# EAGLE design bwrev4 (EAGLE 8.5.0)
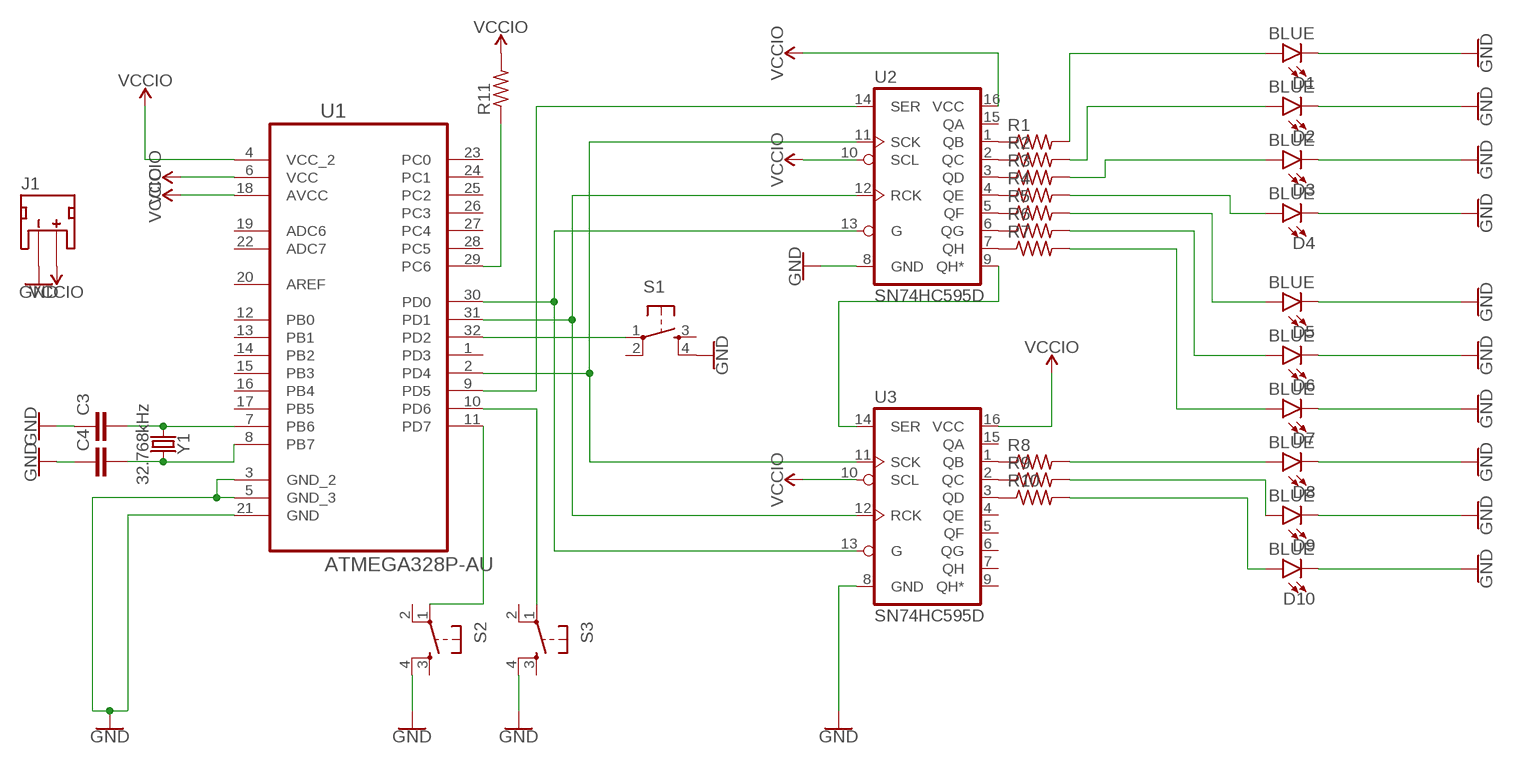
[diagram p0: schematic, sheet 1]

## Parts
C3  C-EUC0805  [C0805]
C4  C-EUC0805  [C0805]
D1  BLUE  LED-BLUE1206  [LED-1206]
D2  BLUE  LED-BLUE1206  [LED-1206]
D3  BLUE  LED-BLUE1206  [LED-1206]
D4  BLUE  LED-BLUE1206  [LED-1206]
D5  BLUE  LED-BLUE1206  [LED-1206]
D6  BLUE  LED-BLUE1206  [LED-1206]
D7  BLUE  LED-BLUE1206  [LED-1206]
D8  BLUE  LED-BLUE1206  [LED-1206]
D9  BLUE  LED-BLUE1206  [LED-1206]
D10  BLUE  LED-BLUE1206  [LED-1206]
J1  JST_2MM_MALE  [JST-2-SMD]
R1  R-US_M0805  [M0805]
R2  R-US_M0805  [M0805]
R3  R-US_M0805  [M0805]
R4  R-US_M0805  [M0805]
R5  R-US_M0805  [M0805]
R6  R-US_M0805  [M0805]
R7  R-US_M0805  [M0805]
R8  R-US_M0805  [M0805]
R9  R-US_M0805  [M0805]
R10  R-US_M0805  [M0805]
R11  R-US_M0805  [M0805]
S1  TAC_SWITCHPTH  [TACTILE-PTH]
S2  TAC_SWITCHPTH  [TACTILE-PTH]
S3  TAC_SWITCHPTH  [TACTILE-PTH]
U1  ATMEGA328P-AU  [QFP80P900X900X120-32N]
U2  SN74HC595D  74HC595D  [SO16]
U3  SN74HC595D  74HC595D  [SO16]
Y1  32.768kHz  CRYSTAL-32.768KHZSMD-3.2X1.5  [CRYSTAL-SMD-3.2X1.5MM]

## Nets
GND: C3.1 C4.1 D1.C D2.C D3.C D4.C D5.C D6.C D7.C D8.C D9.C D10.C J1.1(-) S1.4 S2.4 S3.4 U1.3(GND_2) U1.5(GND_3) U1.21(GND) U2.8(GND) U3.8(GND)
N$1: S1.1 U1.32(PD2)
N$2: R1.1 U2.1(QB)
N$3: R2.1 U2.2(QC)
N$4: R3.1 U2.3(QD)
N$5: R4.1 U2.4(QE)
N$6: R5.1 U2.5(QF)
N$7: R6.1 U2.6(QG)
N$8: R7.1 U2.7(QH)
N$9: R8.1 U3.1(QB)
N$10: R9.1 U3.2(QC)
N$11: S3.1 U1.10(PD6)
N$12: C4.2 U1.8(PB7) Y1.P$2
N$13: C3.2 U1.7(PB6) Y1.P$1
N$14: R10.1 U3.3(QD)
N$15: D4.A R4.2
N$16: D5.A R5.2
N$17: D1.A R1.2
N$18: D2.A R2.2
N$19: D3.A R3.2
N$20: D6.A R6.2
N$21: D7.A R7.2
N$22: D8.A R8.2
N$23: D9.A R9.2
N$24: D10.A R10.2
N$25: U2.9(QH*) U3.14(SER)
N$27: U1.30(PD0) U2.13(G) U3.13(G)
N$28: U1.9(PD5) U2.14(SER)
N$29: U1.31(PD1) U2.12(RCK) U3.12(RCK)
N$30: U1.2(PD4) U2.11(SCK) U3.11(SCK)
N$31: R11.1 U1.29(PC6)
N$32: S2.1 U1.11(PD7)
VCCIO: J1.2(+) R11.2 U1.4(VCC_2) U1.6(VCC) U1.18(AVCC) U2.10(SCL) U2.16(VCC) U3.10(SCL) U3.16(VCC)
Unconnected: J1.NC1(PAD1) J1.NC2(PAD2) S1.2 S1.3 S2.2 S2.3 S3.2 S3.3 U1.1(PD3) U1.12(PB0) U1.13(PB1) U1.14(PB2) U1.15(PB3) U1.16(PB4) U1.17(PB5) U1.19(ADC6) U1.20(AREF) U1.22(ADC7) U1.23(PC0) U1.24(PC1) U1.25(PC2) U1.26(PC3) U1.27(PC4) U1.28(PC5) U2.15(QA) U3.4(QE) U3.5(QF) U3.6(QG) U3.7(QH) U3.9(QH*) U3.15(QA)

## Library data of the parts
C3 C4 = rcl:C-EU: CAPACITOR, European symbol; SPICEPREFIX: C
D1-D10 = SparkFun-LED:LED-BLUE: Blue SMD LED Used in manufacturing of various products at SparkFun Packages: 0603 - SMD 0603 package [Product Link] <http://www.digikey.com/product-detail/en/SMLE12BC7TT86/511-1589-2-ND/1641808> 1206 - SMD1206 package [Product Link] <http://www.digikey.com/product-detail/en/lite-on-inc/LTST-C150TBKT/160-1643-1-ND/573584> SparkFun Products: ESP8266 Thing-Dev Board <https://www.sparkfun.com/products/13711> RedBoard <https://www.sparkfun.com/products/12757>; PROD_ID: DIO-09911
J1 = SparkFun-Connectors:JST_2MM_MALE: JST 2MM MALE RA CONNECTOR Two pin, compact surface mount connector. Commonly used as a battery input connection point. We really like the solid locking feeling and high current rating on these small connectors. We use these all the time as battery connectors. Mates to single-cell LiPo batteries. Here is the connector we sell at SparkFun: JST Right Angle Connector - White <https://www.sparkfun.com/products/8612> (PRT-08612) Datasheet <http://www.sparkfun.com/datasheets/Prototyping/Connectors/JST-Horizontal.pdf> It was used on these SparkFun products: SparkFun MOSFET Power Controller <https://www.sparkfun.com/products/11214> (PRT-11214) SparkFun Battery Babysitter - LiPo Battery Manager <https://www.sparkfun.com/products/13777> (PRT-13777) And many, many others that required a lipo battery connection.; PROD_ID: CONN-11443; SF_ID: PRT-08612
R1-R11 = rcl:R-US_: RESISTOR, American symbol; SPICEPREFIX: R
S1 S3 = SparkFun-Retired:TAC_SWITCH: Momentary Switch Button commonly used for reset or general input. Spark Fun Electronics SKU : COM-00097 SMT- SWCH-08247
S2 = SparkFun-Retired:TAC_SWITCH: Momentary Switch Button commonly used for reset or general input. Spark Fun Electronics SKU : COM-00097 SMT- SWCH-08247; SPICEPREFIX: S
U1 = Atmel_By_element14_Batch_1-00:ATMEGA328P-AU: 8-bit Microcontroller with In-System Programmable Flash; MPN: ATMEGA328P-AU; OC_FARNELL: 1715486; OC_NEWARK: 14R4631; PACKAGE: TQFP-32; SUPPLIER: Atmel
U2 U3 = SparkFun-IC-Logic:74*595: 8-Bit Shift Register (Serial to Parallel) Datasheet <http://cdn.sparkfun.com/datasheets/BreakoutBoards/MM74HC595.pdf> SparkFun Products SparkFun Shift Register Breakout - 74HC595 <https://www.sparkfun.com/products/10680> (BOB-10680); PROD_ID: IC-07875
Y1 = SparkFun-Clocks:CRYSTAL-32.768KHZ: 32.768kHz Crystal Frequency: 32.768kHz Frequency Stability: ±20ppm Load Capacitance: 12.5pF (PTH-2X6 & SMD-3.2X1.5), 6pF (SMD-2X6) SparkFun Products: SparkFun BigTime Watch Kit <https://www.sparkfun.com/products/11734> SparkFun nRF52832 Breakout <https://www.sparkfun.com/products/13990> SparkFun Real Time Clock Module <https://www.sparkfun.com/products/12708>; PROD_ID: XTAL-13062

## Net classes
0 default: clearance 0.205 mm

## Board
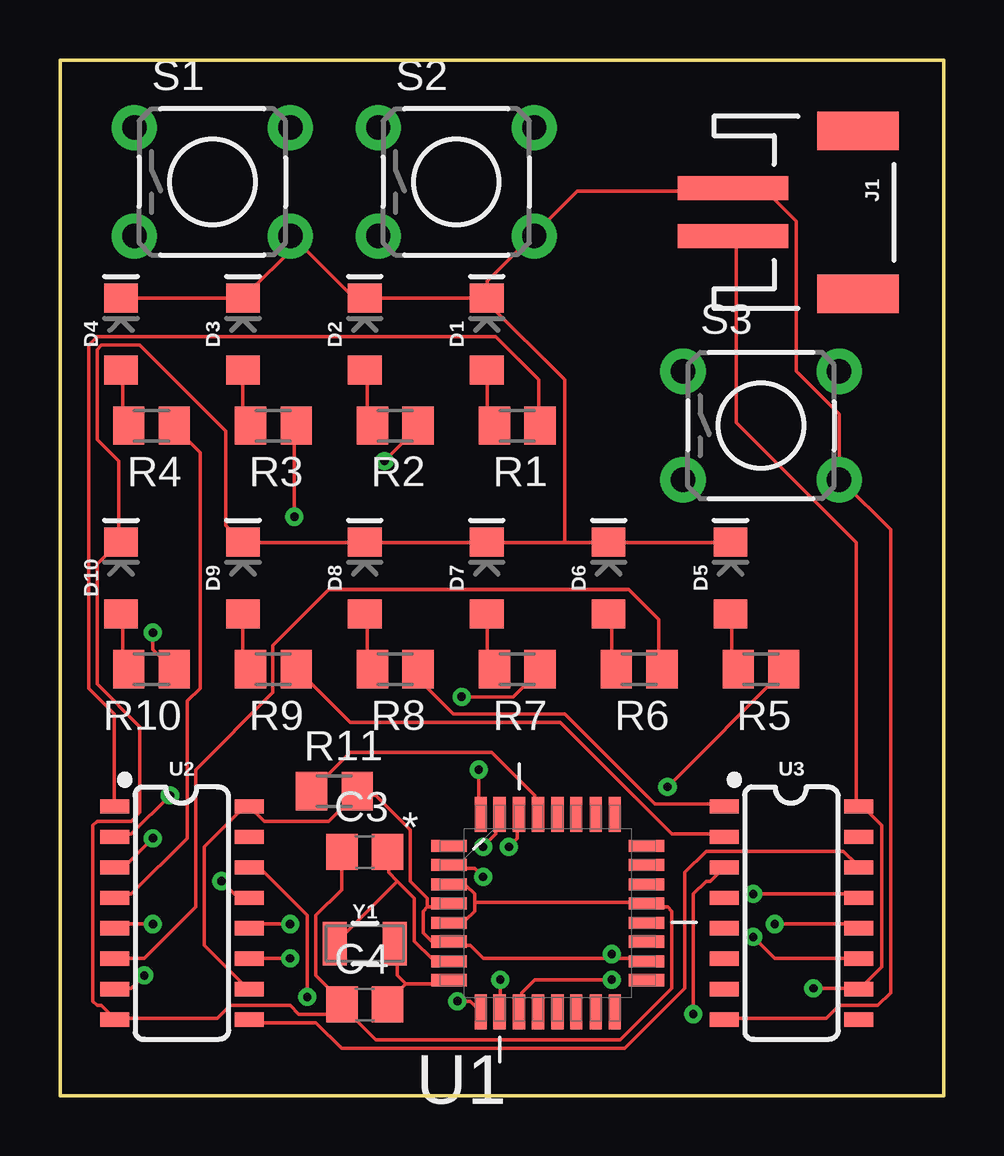
[diagram p1: board, top side]
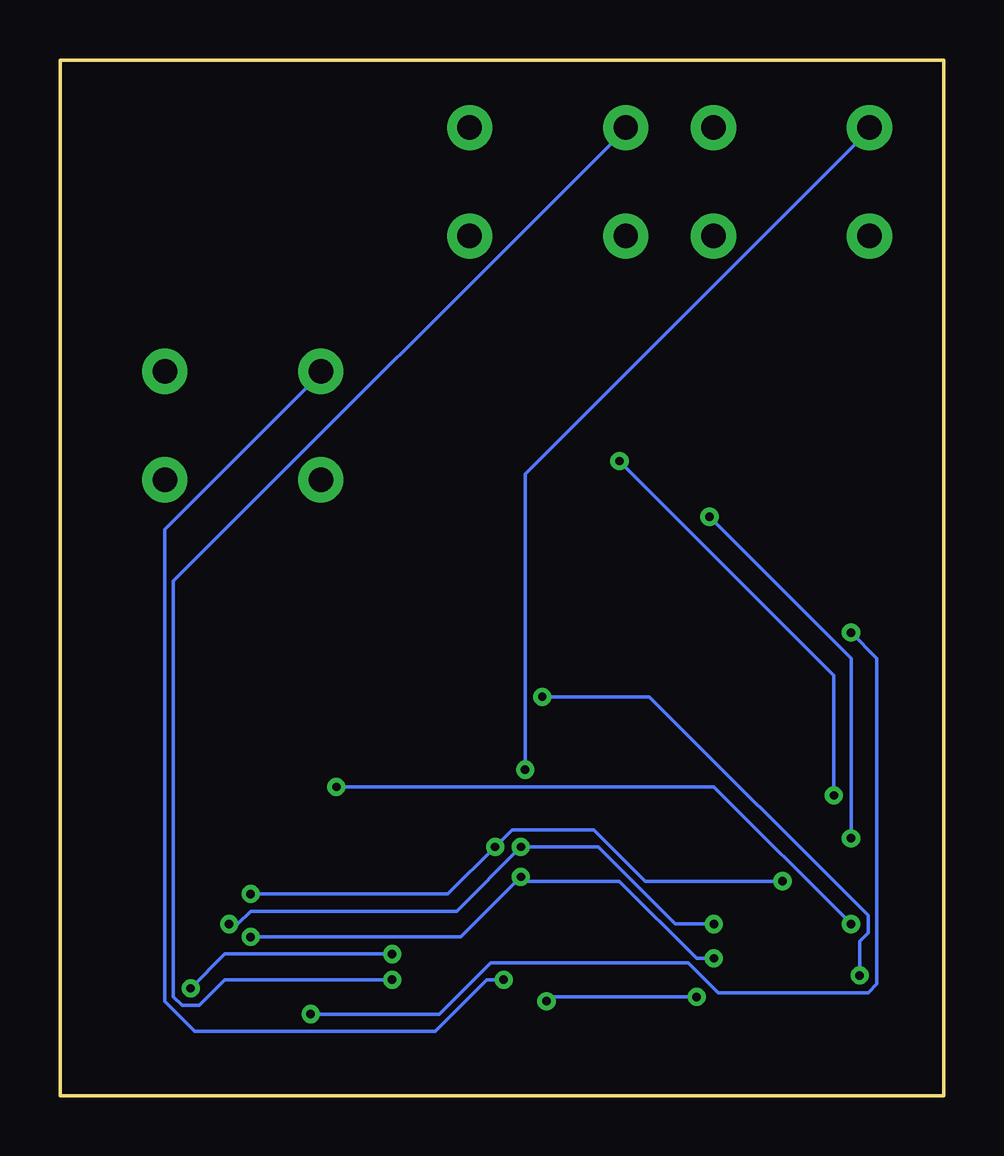
[diagram p2: board, bottom side, seen from below]

Size 36.83 x 43.18 mm. Coordinates in mm from the lower left corner, seen from the top.
Outline: 0,43.17 0,0
Outline: 0,0 0,43.18 36.83,43.18 36.83,0 0,0
Copper layers (1*16): Top 0.035mm / dielectric 1.5mm / Bottom 0.035mm
Design rules "default": minimum track width 6mil, minimum drill 0.35mm, track to track 6mil, track to pad 6mil, pad to pad 6mil, via to via 6mil, smd to smd 6mil, copper to edge 40mil, drill to drill 6mil, minimum pad ring 10mil, minimum via ring 8mil, stop-mask expansion 4mil, vias tented up to drill 0mil, thermal gap 10mil

### Footprints (pad centres in the part's own frame; a part is rotated, then mirrored left to right if it is on the bottom)
C0805 = smd 1.3 x 1.5: 1 -0.95,0; 2 0.95,0
LED-1206 = smd 1.2 x 1.4: A -1.5,0; C 1.5,0
JST-2-SMD = smd 1 x 4.6: 1 -1,-3.7; 2 1,-3.7 | smd 1.6 x 3.4: NC1 -3.4,1.5; NC2 3.4,1.5
M0805 = smd 1.3 x 1.6: 1 -0.95,0; 2 0.95,0
TACTILE-PTH = drill 1.016 pad 1.88: 1 -3.251,2.261; 2 3.251,2.261; 3 -3.251,-2.261; 4 3.251,-2.261
QFP80P900X900X120-32N = smd 1.473 x 0.508: 1 -4.115,2.794; 2 -4.115,2.007; 3 -4.115,1.194; 4 -4.115,0.406; 5 -4.115,-0.406; 6 -4.115,-1.194; 7 -4.115,-2.007; 8 -4.115,-2.794; 17 4.115,-2.794; 18 4.115,-2.007; 19 4.115,-1.194; 20 4.115,-0.406; 21 4.115,0.406; 22 4.115,1.194; 23 4.115,2.007; 24 4.115,2.794 | smd 0.508 x 1.473: 9 -2.794,-4.115; 10 -2.007,-4.115; 11 -1.194,-4.115; 12 -0.406,-4.115; 13 0.406,-4.115; 14 1.194,-4.115; 15 2.007,-4.115; 16 2.794,-4.115; 25 2.794,4.115; 26 2.007,4.115; 27 1.194,4.115; 28 0.406,4.115; 29 -0.406,4.115; 30 -1.194,4.115; 31 -2.007,4.115; 32 -2.794,4.115
SO16 = smd 0.6 x 1.2: 1 -4.445,-2.8; 2 -3.175,-2.8; 3 -1.905,-2.8; 4 -0.635,-2.8; 5 0.635,-2.8; 6 1.905,-2.8; 7 3.175,-2.8; 8 4.445,-2.8; 9 4.445,2.8; 10 3.175,2.8; 11 1.905,2.8; 12 0.635,2.8; 13 -0.635,2.8; 14 -1.905,2.8; 15 -3.175,2.8; 16 -4.445,2.8
CRYSTAL-SMD-3.2X1.5MM = smd 1 x 1.8: P$1 -1.25,0; P$2 1.25,0

### Placement (x,y rotation side)
C3  12.7,10.16 0 top
C4  12.7,3.81 0 top
D1  17.78,31.75 90 top
D2  12.7,31.75 90 top
D3  7.62,31.75 90 top
D4  2.54,31.75 90 top
D5  27.94,21.59 90 top
D6  22.86,21.59 90 top
D7  17.78,21.59 90 top
D8  12.7,21.59 90 top
D9  7.62,21.59 90 top
D10  2.54,21.59 90 top
J1  31.75,36.83 270 top
R1  19.05,27.94 180 top
R2  13.97,27.94 180 top
R3  8.89,27.94 180 top
R4  3.81,27.94 180 top
R5  29.21,17.78 180 top
R6  24.13,17.78 180 top
R7  19.05,17.78 180 top
R8  13.97,17.78 180 top
R9  8.89,17.78 180 top
R10  3.81,17.78 180 top
R11  11.43,12.7 0 top
S1  6.35,38.1 0 top
S2  16.51,38.1 0 top
S3  29.21,27.94 0 top
U1  20.32,7.62 0 top
U2  5.08,7.62 270 top
U3  30.48,7.62 270 top
Y1  12.7,6.35 0 top

### Tracks (layer width: path | path; a pad name or v marks a point on that pad's centre or on a via)
GND
  Top 0.152: 17.27,8.05 17.27,8.41 16.91,8.77 16.38,8.77 U1.3 | 17.27,8.05 17.27,7.7 16.91,7.34 16.38,7.34 U1.5 | 17.27,8.05 24.42,8.05 U1.21 24.6,7.88 25.31,7.88 25.49,7.7 25.49,4.48 23.35,2.34 13.16,2.34 11.73,3.77 | 11.73,3.77 11.37,3.41 9.94,3.41 9.59,3.77 7.08,3.77 6.55,3.23 2.44,3.23 U2.8 2.26,3.23 1.72,3.77 1.54,3.77 1.37,3.95 1.37,11.27 1.54,11.45 2.97,11.45 3.33,11.81 3.33,15.38 1.54,17.17 1.54,22.17 2.44,23.07 D10.C 2.44,23.24 2.44,26.46 1.54,27.36 1.54,31.11 1.72,31.29 3.33,31.29 6.91,27.71 6.91,23.78 7.44,23.24 D9.C 7.62,23.07 12.62,23.07 D8.C 12.8,23.07 17.63,23.07 D7.C 17.81,23.07 21.02,23.07 | C3.1 11.73,10.02 11.73,8.59 10.66,7.52 10.66,5.02 11.73,3.95 C4.1 11.73,3.77 | D5.C 27.81,23.07 22.99,23.07 D6.C 22.81,23.07 21.02,23.07 | U3.8 27.81,3.23 31.92,3.23 32.46,3.77 34.07,3.77 34.61,4.3 34.61,23.6 32.64,25.57 S3.4 32.46,25.75 32.46,28.43 30.67,30.21 30.67,36.47 29.42,37.72 28.17,37.72 J1.1 27.99,37.72 21.56,37.72 19.77,35.93 S2.4 19.59,35.75 17.81,33.97 17.81,33.25 D1.C | D4.C 2.62,33.25 7.44,33.25 D3.C 9.94,35.58 | 9.94,35.58 9.77,35.75 S1.4 9.94,35.58 | 9.94,35.58 12.27,33.25 12.62,33.25 D2.C 12.8,33.25 17.63,33.25 D1.C | 21.02,23.07 21.02,29.86 17.81,33.07 D1.C
N$1  (via drill 0.35)
  Top 0.152: v17.45,13.59 17.45,11.81 U1.32
  Bottom 0.152: v17.45,13.59 17.45,25.92 3.15,40.22 S1.1
N$2
  Top 0.152: U2.1 2.26,12.16 2.26,15.92 1.19,16.99 1.19,31.29 1.54,31.64 18.16,31.64 19.95,29.86 19.95,28.07 R1.1
N$3  (via drill 0.35)
  Top 0.152: v4.58,12.52 2.97,10.91 2.44,10.91 U2.2 | v13.52,26.46 14.95,27.89 R2.1
  Bottom 0.152: v4.58,12.52 4.58,17.53 v13.52,26.46
N$4  (via drill 0.35)
  Top 0.152: v3.87,10.74 2.8,9.66 2.44,9.66 U2.3 | v9.77,24.14 9.77,27.89 R3.1
  Bottom 0.152: v3.87,10.74 3.87,18.24 v9.77,24.14
N$5
  Top 0.152: U2.4 2.44,8.41 2.97,8.41 5.3,10.74 5.3,16.45 5.83,16.99 5.83,26.82 4.76,27.89 R4.1
N$6  (via drill 0.35)
  Top 0.152: v3.87,7.16 2.44,7.16 U2.5 | v25.31,12.88 30.14,17.7 R5.1
  Bottom 0.152: v3.87,7.16 9.59,12.88 v25.31,12.88
N$7
  Top 0.152: U2.6 2.44,5.73 3.51,5.73 5.66,7.88 5.66,13.59 8.87,16.81 8.87,18.78 11.19,21.1 23.7,21.1 24.96,19.85 24.96,17.88 R6.1
N$8  (via drill 0.35)
  Top 0.152: v3.51,5.02 2.97,4.48 2.44,4.48 U2.7 | v16.73,16.63 18.88,16.63 19.95,17.7 R7.1
  Bottom 0.152: v3.51,5.02 3.51,6.45 3.15,6.8 3.15,7.52 12.27,16.63 v16.73,16.63
N$9
  Top 0.152: U3.1 27.64,12.16 24.78,12.16 21.02,15.92 16.38,15.92 14.95,17.35 14.95,17.7 R8.1
N$10
  Top 0.152: U3.2 27.64,10.91 25.49,10.91 20.84,15.56 12.09,15.56 9.94,17.7 R9.1
N$11  (via drill 0.35)
  Top 0.152: v18.34,4.84 18.34,3.59 U1.10
  Bottom 0.152: v18.34,4.84 19.06,4.84 21.2,2.69 31.21,2.69 32.46,3.95 32.46,23.6 26.03,30.04 S3.1
N$12
  Top 0.152: 14.41,4.66 16.2,4.66 U1.8 | 14.41,4.66 13.7,3.95 C4.2 | 14.41,4.66 14.05,5.02 14.05,6.27 Y1.P$2
N$13
  Top 0.152: 14.05,8.95 13.7,9.31 13.7,10.02 C3.2 | 14.05,8.95 14.77,8.23 14.77,6.45 15.48,5.73 16.2,5.73 U1.7 | 14.05,8.95 11.55,6.45 Y1.P$1
N$14  (via drill 0.35)
  Top 0.152: v26.39,3.41 26.39,8.41 26.92,8.95 27.1,8.95 27.64,9.48 U3.3 | v3.87,19.31 3.87,18.6 4.58,17.88 R10.1
  Bottom 0.152: v26.39,3.41 21.02,3.41 18.88,5.55 10.66,5.55 9.41,4.3 3.15,4.3 2.8,4.66 2.8,18.24 v3.87,19.31
N$15
  Top 0.152: D4.A 2.62,30.21 2.62,28.25 2.8,28.07 R4.2
N$16
  Top 0.152: D5.A 27.99,20.03 27.99,18.06 28.17,17.88 R5.2
N$17
  Top 0.152: D1.A 17.81,30.21 17.81,28.25 17.99,28.07 R1.2
N$18
  Top 0.152: D2.A 12.8,30.21 12.8,28.25 12.98,28.07 R2.2
N$19
  Top 0.152: D3.A 7.62,30.21 7.62,28.25 7.8,28.07 R3.2
N$20
  Top 0.152: D6.A 22.99,20.03 22.99,18.06 23.17,17.88 R6.2
N$21
  Top 0.152: D7.A 17.81,20.03 17.81,18.06 17.99,17.88 R7.2
N$22
  Top 0.152: D8.A 12.8,20.03 12.8,18.06 12.98,17.88 R8.2
N$23
  Top 0.152: D9.A 7.62,20.03 7.62,18.06 7.8,17.88 R9.2
N$24
  Top 0.152: D10.A 2.62,20.03 2.62,18.06 2.8,17.88 R10.2
N$25
  Top 0.152: U2.9 7.98,3.05 10.66,3.05 11.73,1.98 23.53,1.98 26.03,4.48 26.03,9.31 26.92,10.2 32.64,10.2 33.17,9.66 U3.14
N$27  (via drill 0.35)
  Top 0.152: v6.73,8.95 7.26,8.41 7.8,8.41 U2.13 | v18.7,10.38 19.06,10.74 19.06,11.63 U1.30 | v28.89,8.41 33.17,8.41 U3.13
  Bottom 0.152: v6.73,8.95 12.45,8.95 14.59,11.09 17.99,11.09 v18.7,10.38 20.67,8.41 v28.89,8.41
N$28  (via drill 0.35)
  Top 0.152: v10.3,4.12 10.3,7.52 8.34,9.48 7.98,9.48 U2.14 | v16.56,3.95 17.09,3.95 17.45,3.59 U1.9
  Bottom 0.152: v10.3,4.12 16.38,4.12 v16.56,3.95
N$29  (via drill 0.35)
  Top 0.152: v9.59,7.16 7.98,7.16 U2.12 | v17.63,10.38 18.16,10.91 18.16,11.63 U1.31 | v29.78,7.16 33.17,7.16 U3.12
  Bottom 0.152: v9.59,7.16 11.19,7.16 14.41,10.38 v17.63,10.38 20.31,7.7 28.89,7.7 29.42,7.16 v29.78,7.16
N$30  (via drill 0.35)
  Top 0.152: v9.59,5.73 7.98,5.73 U2.11 | v17.63,9.13 17.27,9.48 16.38,9.48 U1.2 | v28.89,6.62 29.78,5.73 33.17,5.73 U3.11
  Bottom 0.152: v9.59,5.73 10.3,5.73 13.52,8.95 17.45,8.95 v17.63,9.13 20.13,6.62 v28.89,6.62
N$31
  Top 0.152: U1.29 19.77,11.81 19.77,12.52 17.99,14.31 12.09,14.31 R11.1
N$32  (via drill 0.35)
  Top 0.152: v22.99,4.84 19.77,4.84 19.24,4.3 19.24,3.59 U1.11
  Bottom 0.152: v22.99,4.84 29.96,4.84 31.03,3.77 31.75,3.77 32.1,4.12 32.1,21.46 13.34,40.22 S2.1
VCCIO  (via drill 0.35)
  Top 0.152: 15.3,7.88 15.13,7.7 15.13,6.8 15.48,6.45 16.2,6.45 U1.6 16.38,6.27 17.09,6.27 17.63,5.73 22.99,5.73 | 15.3,7.88 16.2,7.88 U1.4 | 22.99,5.73 24.42,5.73 U1.18 | U2.10 7.8,4.48 6.01,6.27 6.01,10.38 7.8,12.16 U2.16 7.98,11.99 8.51,11.45 11.19,11.45 12.27,12.52 R11.2 12.45,12.52 13.16,12.52 14.59,11.09 14.59,8.95 15.3,8.23 15.3,7.88 | J1.2 28.17,35.75 28.17,28.07 33.17,23.07 33.17,12.16 U3.16 33.35,12.16 34.25,11.27 34.25,5.38 33.35,4.48 U3.10 33.17,4.48 v31.39,4.48 | v22.99,5.91 22.99,5.73
  Bottom 0.152: v22.99,5.91 29.96,5.91 v31.39,4.48